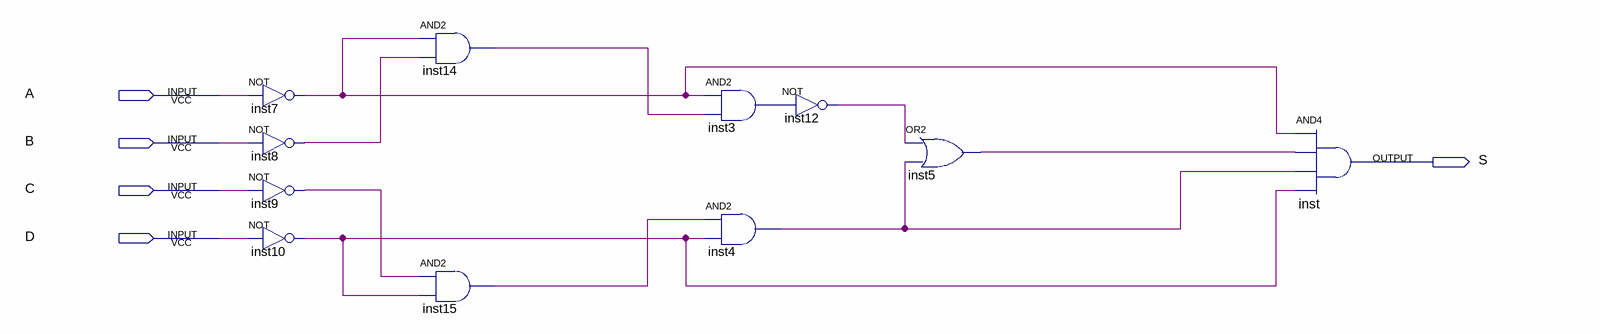
[diagram p0: schematic sheet]
// Quartus schematic mux2x1or.bdf as structural Verilog: 11 symbols, 5 pins
module mux2x1or (
  input  A,
  input  B,
  input  C,
  input  D,
  output S
);

  wire inst3_out, inst4_out, inst5_out, inst7_out, inst8_out, inst9_out, inst10_out, inst12_out, inst14_out,
       inst15_out;

  not inst7 (inst7_out, A);
  not inst8 (inst8_out, B);
  not inst9 (inst9_out, C);
  not inst10 (inst10_out, D);
  and inst14 (inst14_out, inst7_out, inst8_out);
  and inst15 (inst15_out, inst9_out, inst10_out);
  and inst3 (inst3_out, inst7_out, inst14_out);
  and inst4 (inst4_out, inst15_out, inst10_out);
  not inst12 (inst12_out, inst3_out);
  or inst5 (inst5_out, inst12_out, inst4_out);
  and inst (S, inst7_out, inst5_out, inst4_out, inst10_out);
endmodule
